# Altium schematic sheet main.SchDoc
size 431 x 279 mm; SheetNumber: 1; SheetTotal: 1; ENG_APP_DATE: --/--/--; DSN_APP_DATE: --/--/--; CHK_APP_DATE: --/--/--
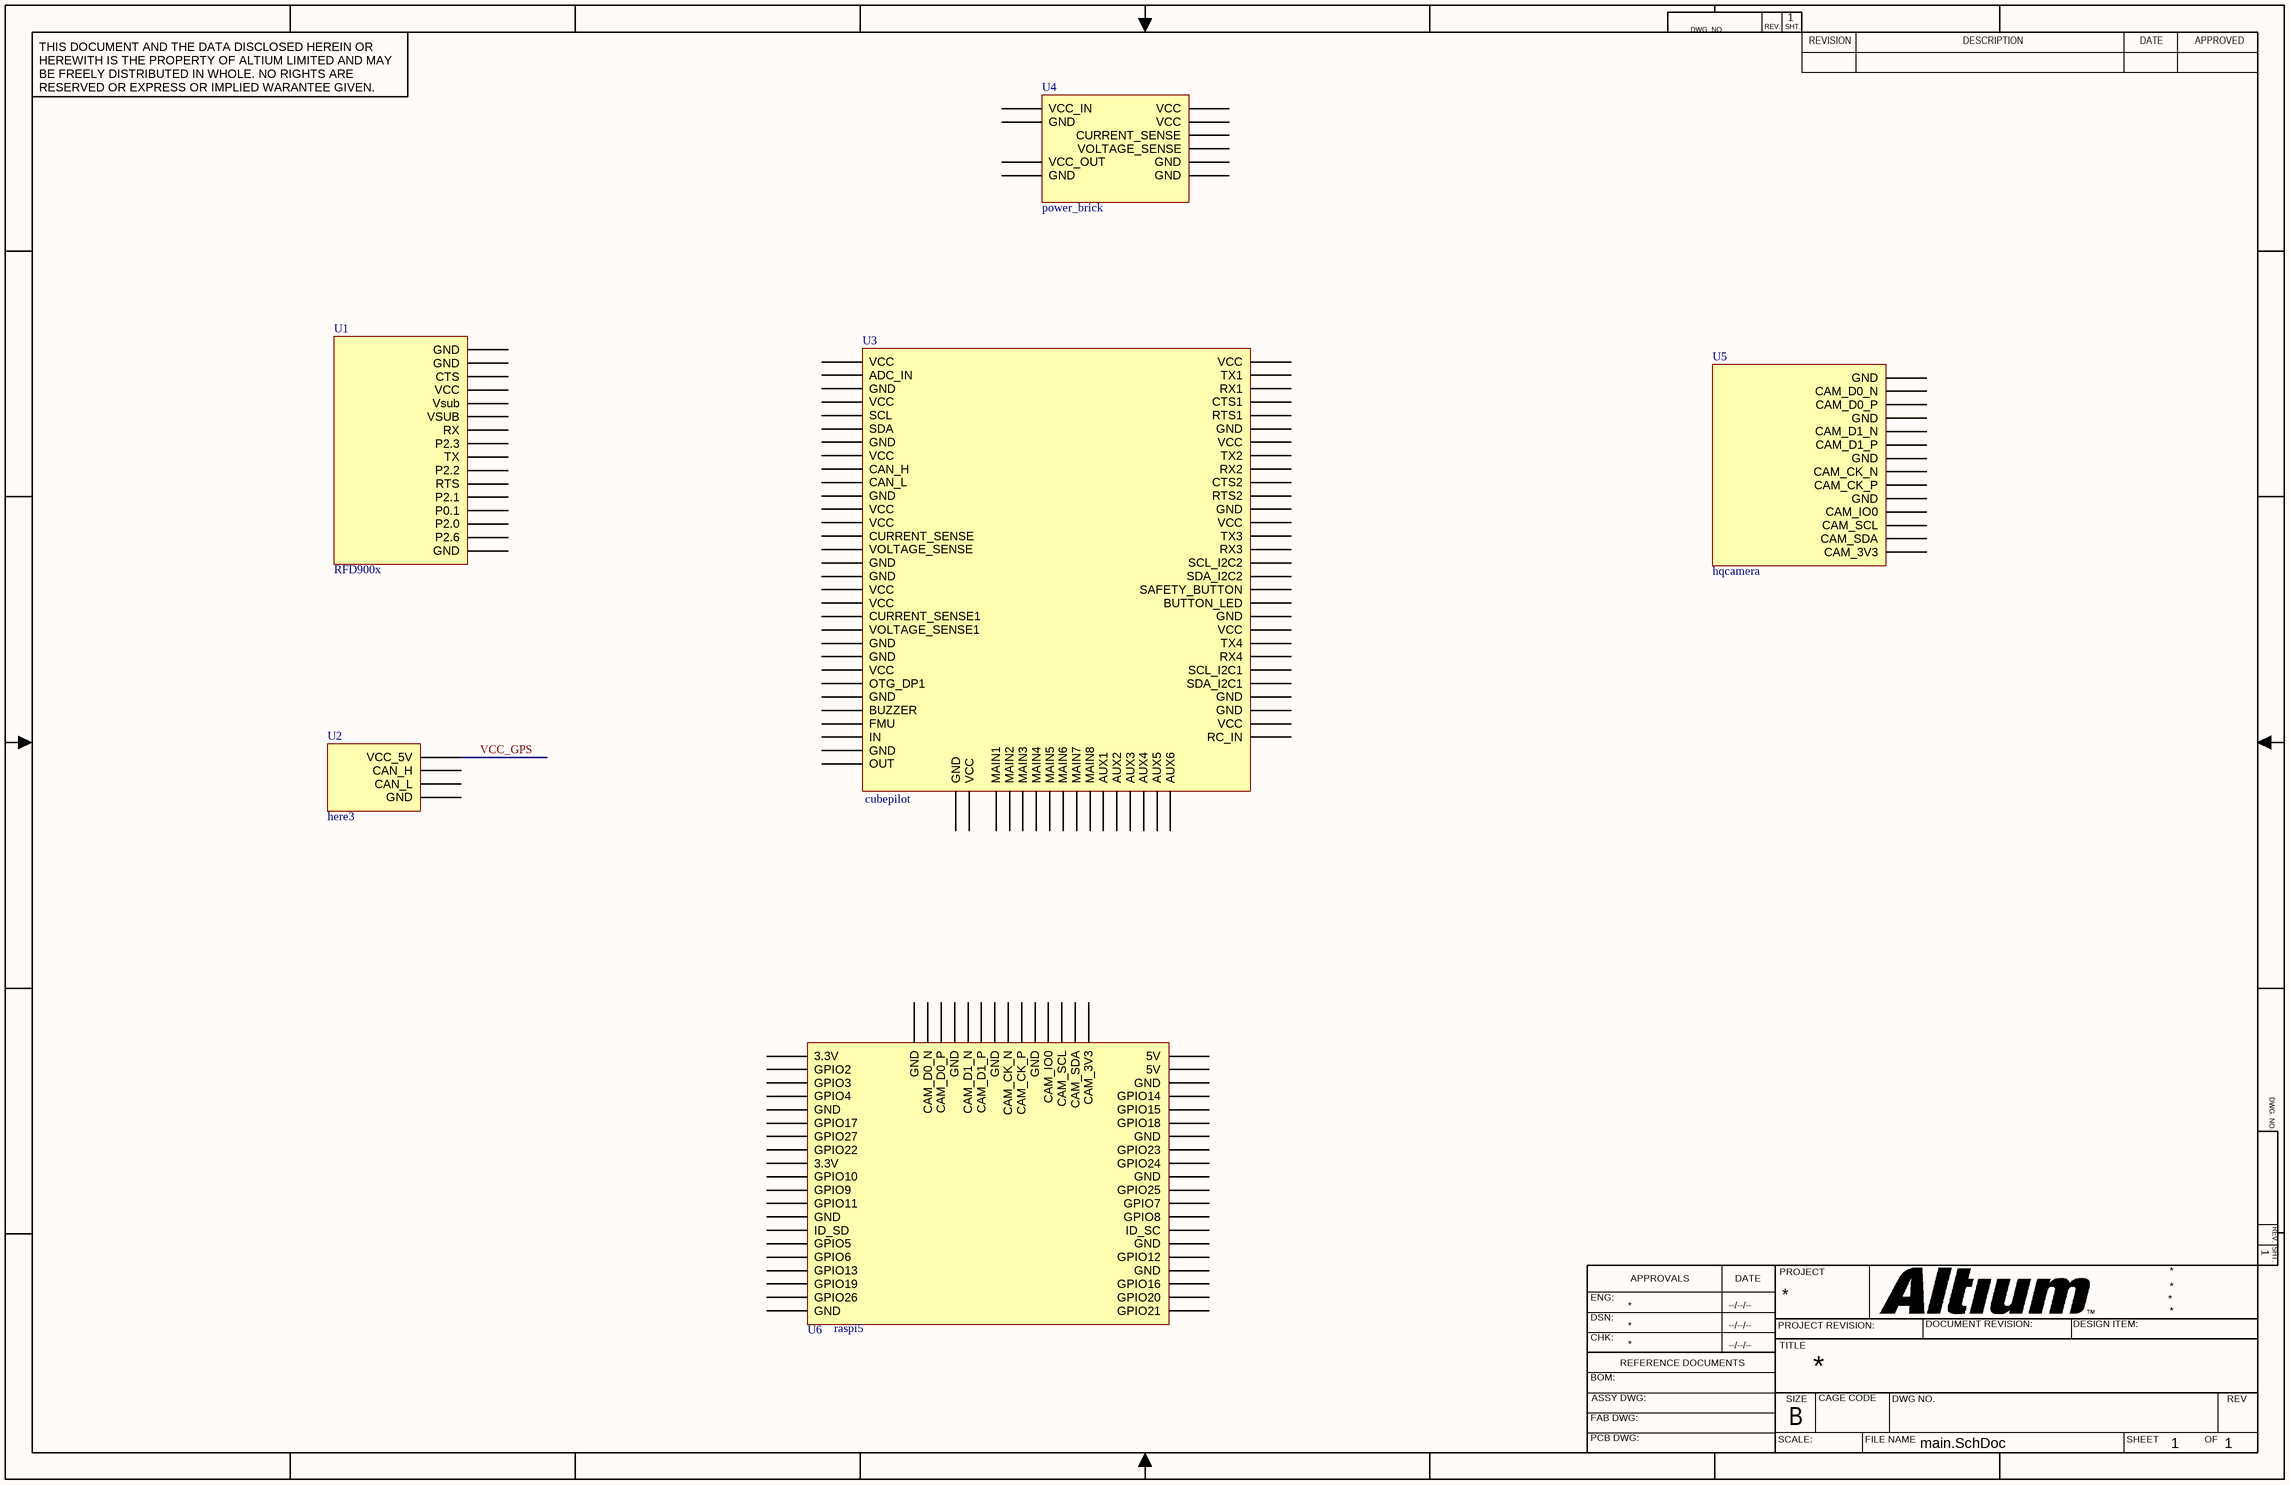
[diagram p0: main.SchDoc]

## Parts
U1  RFD900x
U2  here3
U3  cubepilot
U4  power_brick
U5  hqcamera
U6  raspi5

## Nets
VCC_GPS: U2.27(VCC_5V)

Not connected (* = marked no-connect by the designer): U1 11(GND) 12(GND) 13(CTS) 15(Vsub) 16(VSUB) 17(RX) 18(P2.3) 19(TX) 20(P2.2) 21(RTS) 22(P2.1) 23(P0.1) 24(P2.0) 25(P2.6) 26(GND) ?1(VCC); U2 28(CAN_H) 29(CAN_L) 30(GND); U3 31(VCC) 32(TX1) 33(RX1) 34(CTS1) 35(RTS1) 36(GND) 37(VCC) 38(TX2) 39(RX2) 40(CTS2) 41(RTS2) 42(GND) 46(SCL_I2C2) 47(SDA_I2C2) 48(SAFETY_BUTTON) 49(BUTTON_LED) 50(GND) 51(VCC) 52(TX4) 53(VCC) 54(ADC_IN) 55(GND) 56(VCC) 57(SCL) 58(SDA) 59(GND) 60(VCC) 61(CAN_H) 62(CAN_L) 63(GND) 65(VCC) 67(VOLTAGE_SENSE) 68(GND) 69(GND) 70(VCC) 71(VCC) 72(CURRENT_SENSE1) 73(VOLTAGE_SENSE1) 74(GND) ?1(TX3) ?2(VCC) ?3(CURRENT_SENSE) ?4(GND) ?5(IN) ?6(GND) ?7(OUT) ?8(GND) ?9(VCC) ?10(AUX5) RC_IN RX3 SDA_I2C1 VCC; U4 ?1(GND) ?2(GND) ?3(GND) ?4(VCC_OUT) VCC; U5 ?1(GND) ?2(CAM_D0_N) ?3(CAM_D0_P) ?4(GND) ?5(CAM_D1_N) ?6(CAM_D1_P) ?7(GND) ?8(CAM_CK_N) ?9(CAM_CK_P) ?10(GND) ?11(CAM_IO0) ?12(CAM_SCL) ?13(CAM_SDA) ?14(CAM_3V3); U6 ?1(GND) ?2(CAM_D0_N) ?3(CAM_D0_P) ?4(GND) ?5(CAM_D1_N) ?6(CAM_D1_P) ?7(GND) ?8(CAM_CK_N) ?9(CAM_CK_P) ?10(GND) ?11(CAM_IO0) ?12(CAM_SCL) ?13(CAM_SDA) ?14(CAM_3V3) ?15(GND) ?16(GPIO26) ?17(GPIO19) ?18(GPIO13) ?19(GPIO6) ?20(GPIO5) ?21(ID_SD) ?22(GND) ?23(GPIO11) ?24(GPIO9) ?25(GPIO10) ?26(3.3V) ?27(GPIO22) ?28(GPIO27) ?29(GPIO17) ?30(GND) ?31(GPIO4) ?32(GPIO3) ?33(GPIO2) ?34(3.3V) ?35(GPIO25) ?36(GPIO21) ?37(GPIO20) ?38(GPIO16) ?39(GND) ?40(GPIO12) ?41(GND) ?42(ID_SC) ?43(GPIO8) ?44(GPIO7) ?45(GND) ?46(GPIO24) ?47(GPIO23) ?48(GND) ?49(GPIO18) ?50(GPIO15) ?51(GPIO14) ?52(GND) ?53(5V) ?54(5V)

## Notes on the sheet
- DWG. NO.
- REV.
- SHT.
- THIS DOCUMENT AND THE DATA DISCLOSED HEREIN OR HEREWITH IS THE PROPERTY OF ALTIUM LIMITED AND MAY BE FREELY DISTRIBUTED IN WHOLE. NO RIGHTS ARE RESERVED OR EXPRESS OR IMPLIED WARANTEE GIVEN.
- REVISION
- DESCRIPTION
- DATE
- APPROVED
- ENG:
- APPROVALS
- PROJECT
- DSN:
- CHK:
- REFERENCE DOCUMENTS
- PROJECT REVISION:
- TITLE
- DOCUMENT REVISION:
- DESIGN ITEM:
- BOM:
- FAB DWG:
- PCB DWG:
- ASSY DWG:
- SCALE:
- SIZE
- B
- CAGE CODE
- FILE NAME
- DWG NO.
- SHEET
- OF
- REV